# EAGLE design Monlock5x7 (EAGLE 7.2.0)
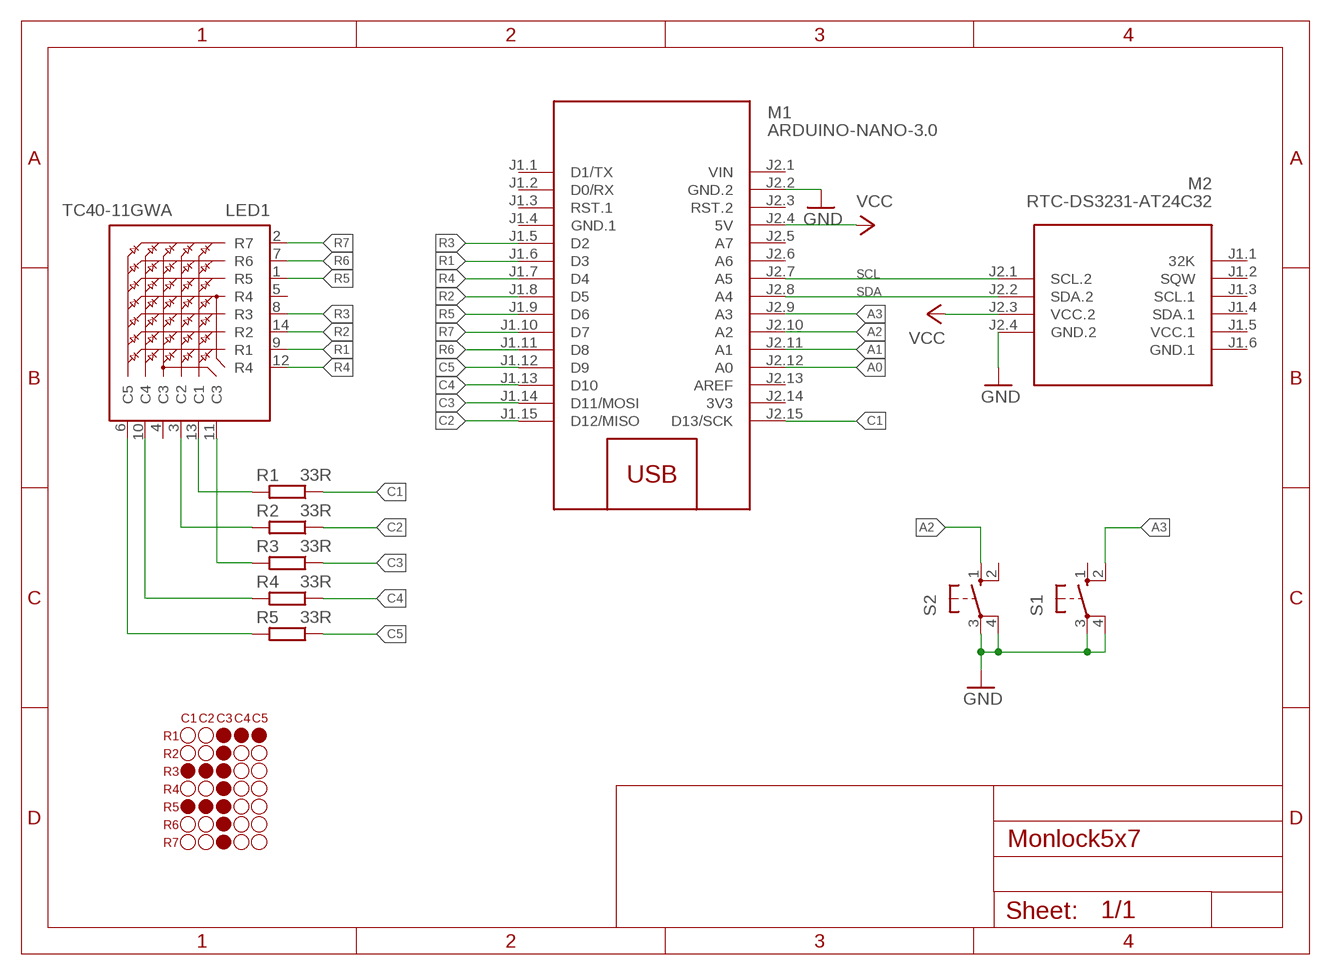
[diagram p0: schematic, sheet 1]

## Parts
LED1  TC40-11GWA  [TC40-11GWA]
M1  ARDUINO-NANO-3.0  [ARDUINO-NANO-3.0]
M2  RTC-DS3231-AT24C32  [RTC-DS3231-AT24C32]
R1  33R  R-EU_0204/7  [0204/7]
R2  33R  R-EU_0204/7  [0204/7]
R3  33R  R-EU_0204/7  [0204/7]
R4  33R  R-EU_0204/7  [0204/7]
R5  33R  R-EU_0204/7  [0204/7]
S1  40-XX  [B3F-40XX]
S2  40-XX  [B3F-40XX]

## Nets
A0: M1.J2.12(A0)
A1: M1.J2.11(A1)
A2: M1.J2.10(A2) S2.1(S)
A3: M1.J2.9(A3) S1.2(S1)
C1: M1.J2.15(D13/SCK) R1.1
C2: M1.J1.15(D12/MISO) R2.1
C3: M1.J1.14(D11/MOSI) R3.1
C4: M1.J1.13(D10) R4.1
C5: M1.J1.12(D9) R5.1
CC1: LED1.13(C1) R1.2
CC2: LED1.3(C2) R2.2
CC3: LED1.11(C3) R3.2
CC4: LED1.10(C4) R4.2
CC5: LED1.6(C5) R5.2
GND: M1.J2.2(GND.2) M2.J2.4(GND.2) S1.3(P) S1.4(P1) S2.3(P) S2.4(P1)
R1: LED1.9(R1) M1.J1.6(D3)
R2: LED1.14(R2) M1.J1.8(D5)
R3: LED1.8(R3) M1.J1.5(D2)
R4: LED1.12(R4) M1.J1.7(D4)
R5: LED1.1(R5) M1.J1.9(D6)
R6: LED1.7(R6) M1.J1.11(D8)
R7: LED1.2(R7) M1.J1.10(D7)
SCL: M1.J2.7(A5) M2.J2.1(SCL.2)
SDA: M1.J2.8(A4) M2.J2.2(SDA.2)
VCC: M1.J2.4(5V) M2.J2.3(VCC.2)
Unconnected: LED1.4(C3) LED1.5(R4) M1.J1.1(D1/TX) M1.J1.2(D0/RX) M1.J1.3(RST.1) M1.J2.3(RST.2) M1.J2.5(A7) M1.J2.6(A6) M1.J2.13(AREF) M2.J1.1(32K) M2.J1.2(SQW) M2.J1.3(SCL.1) M2.J1.4(SDA.1) S1.1(S) S2.2(S1)

## Notes on the sheet
- C1 | C2 | C3 | C4 | C5
- R1
- R2
- R3
- R4
- R5
- R6
- R7

## Power pins joined to a net without a drawn wire
3V3: M1.J2.14(3V3)
GND: M1.J1.4(GND.1) M2.J1.6(GND.1)
VCC.1: M2.J1.5(VCC.1)
VIN: M1.J2.1(VIN)

## Library data of the parts
LED1 = display-5x7-4inch:TC40-11GWA: 100mm (4.0 INCH) 5x7 DOT MATRIX DISPLAY https://www.kingbrightusa.com/images/catalog/SPEC/TC40-11GWA.pdf; OC_FARNELL: unknown; OC_NEWARK: unknown
M1 = diy-modules:ARDUINO-NANO-3.0: Arduino Nano 3.0 and compatible devices More details available here: https://www.arduino.cc/en/Main/ArduinoBoardNano Click here to find device on ebay.com <http://www.ebay.com/sch/arduino+nano>
M2 = diy-modules:RTC-DS3231-AT24C32: RTC Module with Battery and EEPROM based on DS3231 and AT24C32 chips Tutorial can be found here: https://edwardmallon.wordpress.com/2014/05/21/using-a-cheap-3-ds3231-rtc-at24c32-eeprom-from-ebay/ Click here to find device on ebay.com <http://www.ebay.com/sch/DS3231+AT24C32+module>
R1-R5 = rcl:R-EU_: RESISTOR, European symbol
S1 S2 = switch-omron:40-XX: OMRON SWITCH; MF: OMRON COMPONENTS USA; MPN: B3F-4000; OC_FARNELL: 176434; OC_NEWARK: 36K3105

## Board
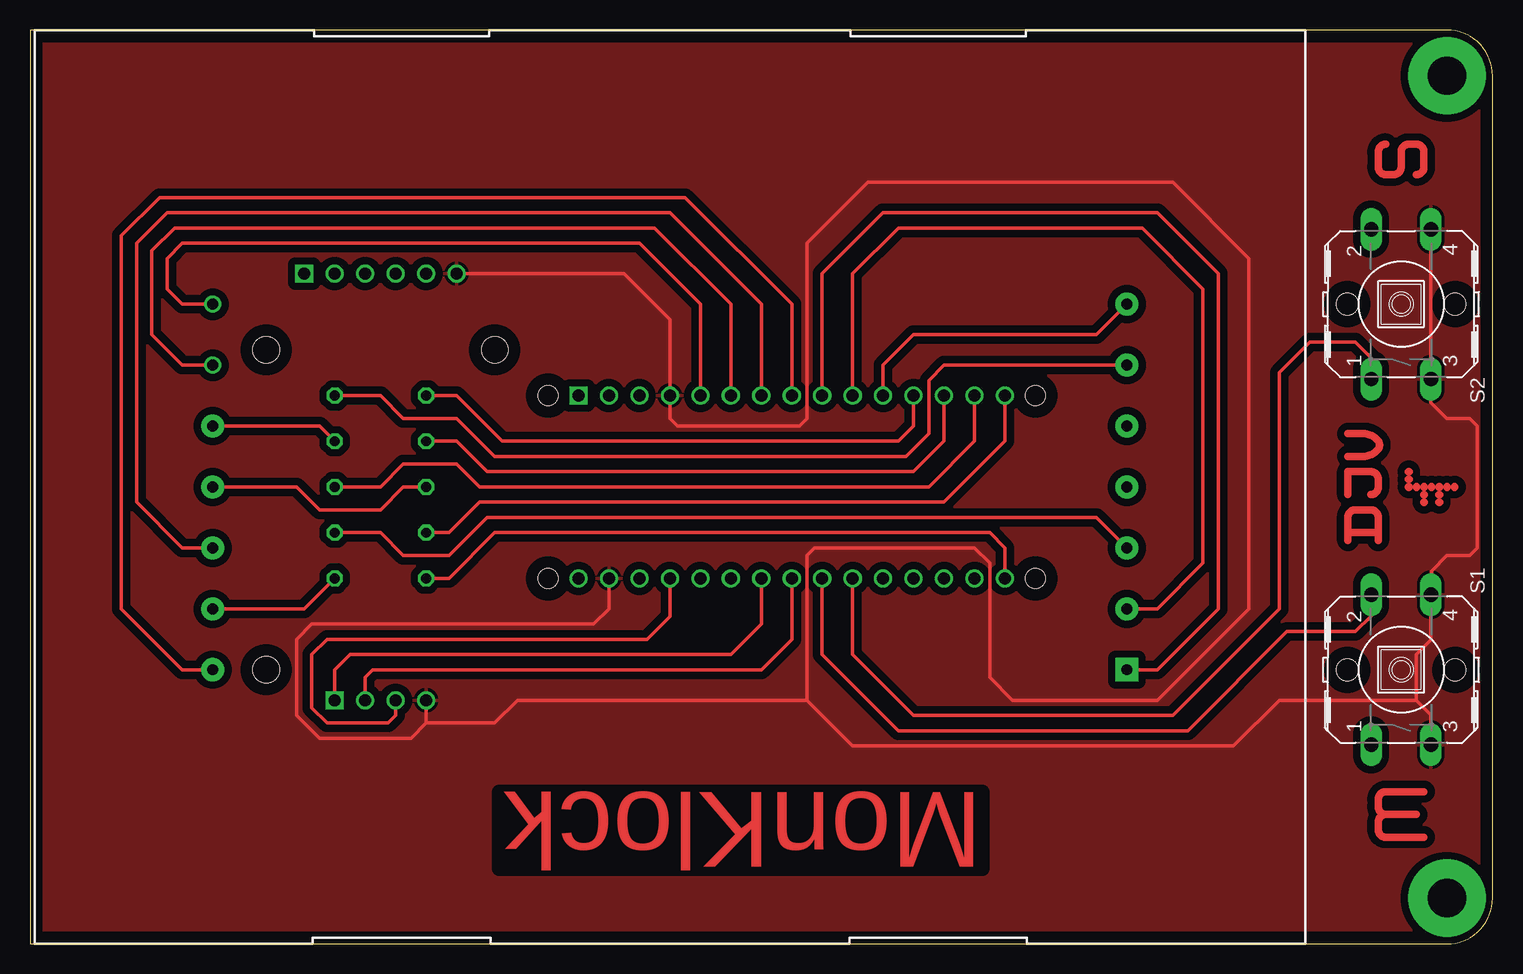
[diagram p1: board, top side]
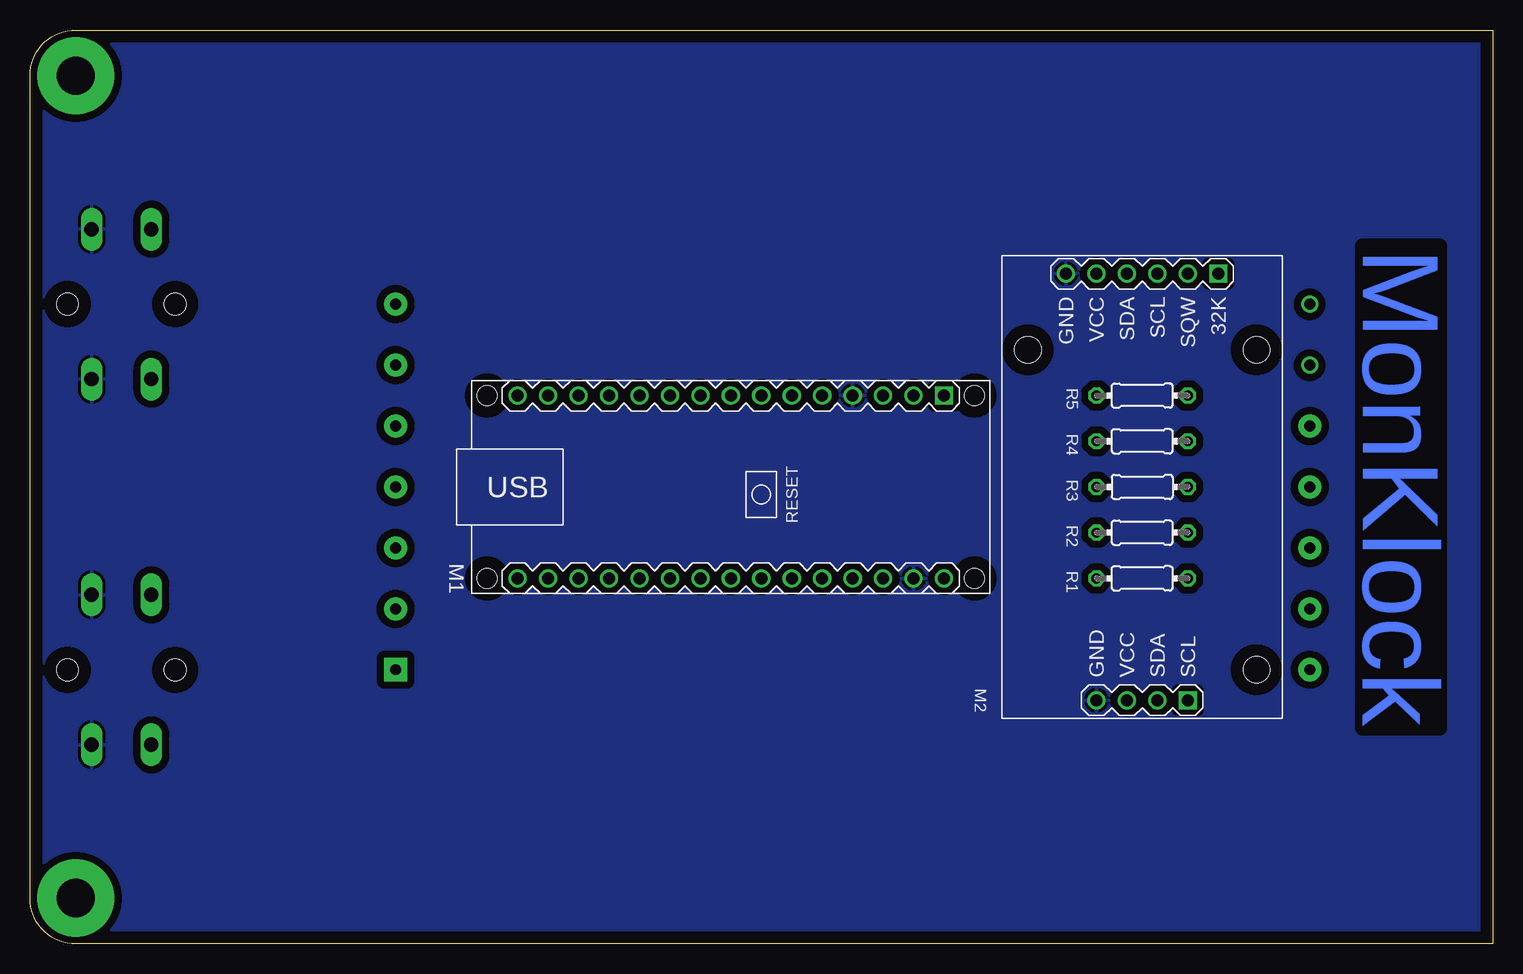
[diagram p2: board, bottom side, seen from below]

Size 121.92 x 76.2 mm. Coordinates in mm from the lower left corner, seen from the top.
Outline: 0,0 118.11,0 arc90 121.92,3.81 121.92,72.39 arc90 118.11,76.2 0,76.2 0,0
Copper layers (1*16): Top 0.035mm / dielectric 1.5mm / Bottom 0.035mm
Design rules "default *": minimum track width 10mil, minimum drill 24mil, track to track 8mil, track to pad 8mil, pad to pad 8mil, via to via 8mil, smd to smd 8mil, copper to edge 40mil, drill to drill 8mil, minimum pad ring 10mil, minimum via ring 8mil, stop-mask expansion 4mil, vias tented up to drill 0mil, thermal gap 10mil

### Footprints (pad centres in the part's own frame; a part is rotated, then mirrored left to right if it is on the bottom)
TC40-11GWA = drill 0.9 pad 1.93 square: 1 -15.24,-38.1 | drill 0.9 pad 1.93: 2 -10.16,-38.1; 3 -5.08,-38.1; 4 0,-38.1; 5 5.08,-38.1; 6 10.16,-38.1; 7 15.24,-38.1; 10 5.08,38.1; 11 0,38.1; 12 -5.08,38.1; 13 -10.16,38.1; 14 -15.24,38.1 | drill 0.9 pad 1.4: 8 15.24,38.1; 9 10.16,38.1
ARDUINO-NANO-3.0 = drill 1 square: J1.1 17.78,7.62 | drill 1: J1.2 15.24,7.62; J1.3 12.7,7.62; J1.4 10.16,7.62; J1.5 7.62,7.62; J1.6 5.08,7.62; J1.7 2.54,7.62; J1.8 0,7.62; J1.9 -2.54,7.62; J1.10 -5.08,7.62; J1.11 -7.62,7.62; J1.12 -10.16,7.62; J1.13 -12.7,7.62; J1.14 -15.24,7.62; J1.15 -17.78,7.62; J2.1 17.78,-7.62; J2.2 15.24,-7.62; J2.3 12.7,-7.62; J2.4 10.16,-7.62; J2.5 7.62,-7.62; J2.6 5.08,-7.62; J2.7 2.54,-7.62; J2.8 0,-7.62; J2.9 -2.54,-7.62; J2.10 -5.08,-7.62; J2.11 -7.62,-7.62; J2.12 -10.16,-7.62; J2.13 -12.7,-7.62; J2.14 -15.24,-7.62; J2.15 -17.78,-7.62 | hole 1.651: -20.32,7.62; -20.32,-7.62; 20.32,-7.62; 20.32,7.62
RTC-DS3231-AT24C32 = drill 1 square: J1.1 -17.78,6.35; J2.1 17.78,3.81 | drill 1: J1.2 -17.78,3.81; J1.3 -17.78,1.27; J1.4 -17.78,-1.27; J1.5 -17.78,-3.81; J1.6 -17.78,-6.35; J2.2 17.78,1.27; J2.3 17.78,-1.27; J2.4 17.78,-3.81 | hole 2.2: -11.43,-9.525; -11.43,9.525; 15.24,9.525
0204/7 = drill 0.813 octagon: 1 -3.81,0; 2 3.81,0
B3F-40XX = drill 1.194 long: 1 -6.248,2.489; 2 6.248,2.489; 3 -6.248,-2.489; 4 6.248,-2.489 | hole 1.803: 0,-4.496; 0,4.496

### Placement (x,y rotation side)
LED1  53.34,38.1 90 top
M1  63.5,38.1 0 bottom
M2  29.21,38.1 270 bottom
R1  29.21,30.48 0 bottom
R2  29.21,34.29 0 bottom
R3  29.21,38.1 180 bottom
R4  29.21,41.91 0 bottom
R5  29.21,45.72 0 bottom
S1  114.3,22.86 90 top
S2  114.3,53.34 90 top

### Tracks (layer width: path | path; a pad name or v marks a point on that pad's centre or on a via)
A2
  Top 0.305: M1.J2.10 68.58,24.13 73.66,19.05 95.25,19.05 104.14,27.94 104.14,47.62 106.68,50.16 110.49,50.16 111.81,48.84 S2.1
A3
  Top 0.305: M1.J2.9 66.04,24.13 72.39,17.78 96.52,17.78 104.77,26.04 110.49,26.04 111.81,27.36 S1.2
C1
  Top 0.305: R1.1 34.92,30.48 38.73,34.29 80.01,34.29 81.28,33.02 M1.J2.15
C2
  Top 0.305: R2.1 34.92,34.29 37.47,36.83 76.2,36.83 81.28,41.91 M1.J1.15
C3
  Top 0.305: M1.J1.14 78.74,41.91 74.93,38.1 37.47,38.1 35.56,40.01 31.12,40.01 29.21,38.1 R3.1
C4
  Top 0.305: R4.1 35.56,41.91 38.1,39.37 73.66,39.37 76.2,41.91 M1.J1.13
C5
  Top 0.305: M1.J1.12 73.66,43.18 72.39,41.91 39.37,41.91 35.56,45.72 R5.1
CC1
  Top 0.305: LED1.13 22.86,27.94 R1.2
CC2
  Top 0.305: R2.2 29.21,34.29 31.12,32.38 34.92,32.38 38.1,35.56 88.9,35.56 LED1.3
CC3
  Top 0.305: LED1.11 22.23,38.1 24.13,36.2 29.21,36.2 31.12,38.1 R3.2
CC4
  Top 0.305: LED1.10 24.13,43.18 R4.2
CC5
  Top 0.305: R5.2 29.21,45.72 31.12,43.81 35.56,43.81 38.73,40.64 73.02,40.64 74.93,42.55 74.93,46.99 76.2,48.26 LED1.6
GND
  Top 0.305: M2.J2.4 33.02,18.41 | 33.02,18.41 31.75,17.14 24.13,17.14 22.23,19.05 22.23,25.4 23.5,26.67 46.99,26.67 48.26,27.94 M1.J2.2 | 33.02,18.41 38.73,18.41 40.64,20.32 64.77,20.32 | 64.77,20.32 68.58,16.51 100.33,16.51 104.14,20.32 115.57,20.32 | S1.3 116.79,19.1 115.57,20.32 | 115.57,20.32 115.57,24.13 116.79,25.35 S1.4 116.84,31.11 118.11,32.38 120.02,32.38 120.65,33.02 120.65,43.18 120.02,43.81 118.11,43.81 116.79,45.14 S2.3 S2.4 | M2.J1.6 49.53,55.88 53.34,52.07 M1.J1.4 53.34,43.81 53.98,43.18 64.14,43.18 64.77,43.81 64.77,58.42 69.85,63.5 95.25,63.5 101.6,57.15 101.6,27.94 93.98,20.32 81.91,20.32 80.01,22.23 80.01,31.75 78.74,33.02 65.41,33.02 64.77,32.38 64.77,20.32
  pour Top (isolate 0.61): 0,0 0,76.2 122.55,76.2 122.55,0
  pour Bottom (isolate 0.61): 0,0 0,76.2 121.92,76.2 121.92,0
N$1  (via drill 3.2 pad 6.45)
  other vias: 118.11,72.39
N$2  (via drill 3.2 pad 6.45)
  other vias: 118.11,3.81
N$3
  Top 0.61: 113.03,66.67 arc90 112.39,66.04 112.39,64.77 arc90 113.03,64.14 113.66,64.14 arc90 114.3,64.77 114.3,66.04 arc-90 114.93,66.67 115.57,66.67 arc-90 116.2,66.04 116.2,64.77 arc-90 115.57,64.14
N$13
  Top 0.61: 116.2,8.89 113.03,8.89 arc-90 112.39,9.53 112.39,10.16 arc-90 113.03,10.79 | 116.2,12.7 113.03,12.7 arc90 112.39,12.06 112.39,11.43 arc90 113.03,10.79 | 113.03,10.79 115.57,10.79
N$17
  Top 0.61: 109.85,33.66 109.85,34.29 | 109.85,34.29 109.85,35.56 arc-90 110.49,36.2 111.76,36.2 arc-90 112.39,35.56 112.39,34.29 | 112.39,34.29 112.39,33.66 | 109.85,34.29 112.39,34.29
N$18
  Top 0.61: 109.85,37.47 109.85,39.37 111.76,39.37 arc-90 112.39,38.73 112.39,38.1 arc-90 111.76,37.47
N$19
  Top 0.61: 109.85,42.55 111.12,42.55 arc-53 112.39,41.91 arc-74 112.39,41.27 arc-53 111.12,40.64 109.85,40.64
R1
  Top 0.305: M1.J1.6 58.42,53.34 52.07,59.69 12.07,59.69 10.16,57.78 10.16,50.8 12.7,48.26 LED1.9
R2
  Top 0.305: M1.J1.8 63.5,53.34 54.61,62.23 10.79,62.23 7.62,59.05 7.62,27.94 12.7,22.86 LED1.14
R3
  Top 0.305: M1.J1.5 55.88,53.34 50.8,58.42 12.7,58.42 11.43,57.15 11.43,54.61 12.7,53.34 LED1.8
R4
  Top 0.305: M1.J1.7 60.96,53.34 53.34,60.96 11.43,60.96 8.89,58.42 8.89,36.83 12.7,33.02 LED1.12
R5
  Top 0.305: M1.J1.9 66.04,55.88 71.12,60.96 93.98,60.96 99.06,55.88 99.06,29.21 99.06,27.94 93.98,22.86 92.71,22.86 LED1.1
R6
  Top 0.305: M1.J1.11 71.12,48.26 73.66,50.8 88.9,50.8 LED1.7
R7
  Top 0.305: M1.J1.10 68.58,55.88 72.39,59.69 92.71,59.69 97.79,54.61 97.79,31.75 93.98,27.94 LED1.2
SCL
  Top 0.305: M2.J2.1 25.4,22.86 26.67,24.13 58.42,24.13 60.96,26.67 M1.J2.7
SDA
  Top 0.305: M2.J2.2 27.94,22.23 28.58,22.86 60.96,22.86 63.5,25.4 M1.J2.8
VCC
  Top 0.305: M1.J2.4 53.34,27.3 51.44,25.4 24.77,25.4 23.5,24.13 23.5,19.68 24.77,18.41 29.84,18.41 30.48,19.05 M2.J2.3
(copper drawn outside any net)
  shapes: Top circle x13

### Text on the board
Top: MonKlock
Bottom: MonKlock
tStop: MonKlock
bStop: MonKlock